# EAGLE design untitled (EAGLE 9.6.2)
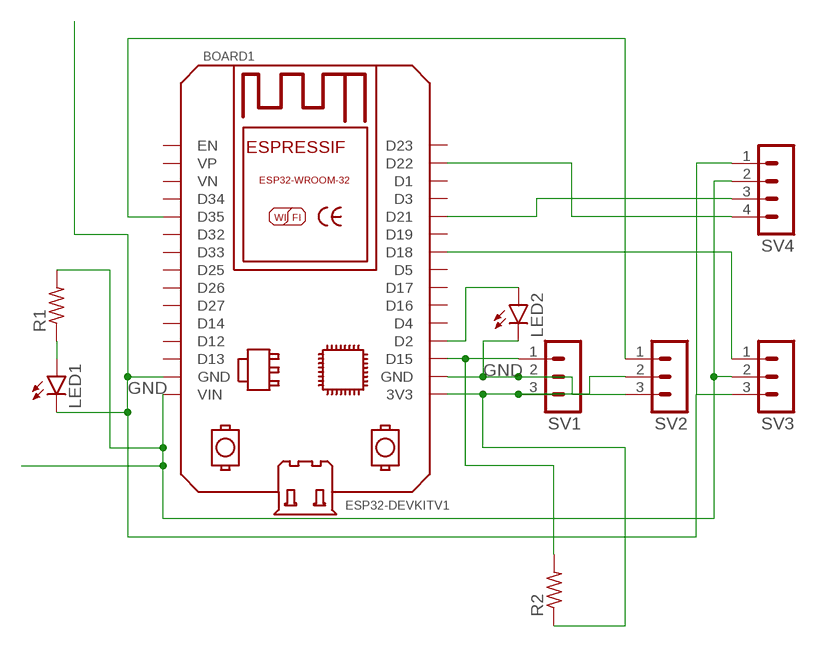
[diagram p0: schematic, sheet 1]

## Parts
BOARD1  ESP32DEVKITV1  [ESP32-DEVKITV1]
LED1  LED5MM  [LED5MM]
LED2  LED5MM  [LED5MM]
R1  R-US_0204/7  [0204/7]
R2  R-US_0204/7  [0204/7]
SV1  MA03-1  [MA03-1]
SV2  MA03-1  [MA03-1]
SV3  MA03-1  [MA03-1]
SV4  MA04-1  [MA04-1]

## Nets
GND: BOARD1.GND BOARD1.GND@1(GND) LED1.K(C) LED2.K(C) SV1.2 SV2.3 SV3.3 SV4.1
N$1: BOARD1.3V3 R2.1 SV1.3 SV2.2
N$3: BOARD1.D15 R2.2 SV1.1
N$5: BOARD1.D18 SV3.1
N$6: LED1.A R1.1
N$7: BOARD1.D21 SV4.3
N$8: BOARD1.D22 SV4.4
N$9: BOARD1.D35 SV2.1
N$11: BOARD1.D2 LED2.A
N$13: BOARD1.VIN R1.2 SV3.2 SV4.2
Unconnected: BOARD1.D1 BOARD1.D3 BOARD1.D4 BOARD1.D5 BOARD1.D12 BOARD1.D13 BOARD1.D14 BOARD1.D16 BOARD1.D17 BOARD1.D19 BOARD1.D23 BOARD1.D25 BOARD1.D26 BOARD1.D27 BOARD1.D32 BOARD1.D33 BOARD1.D34 BOARD1.EN BOARD1.VN BOARD1.VP

## Library data of the parts
BOARD1 = ESP32-DEVKITV1:ESP32DEVKITV1: https://github.com/shridattdudhat
LED1 LED2 = led:LED: LED OSRAM: - CHIPLED LG R971, LG N971, LY N971, LG Q971, LY Q971, LO R971, LY R971 LH N974, LH R974 LS Q976, LO Q976, LY Q976 LO Q996 - Hyper CHIPLED LW Q18S LB Q993, LB Q99A, LB R99A - SideLED LS A670, LO A670, LY A670, LG A670, LP A670 LB A673, LV A673, LT A673, LW A673 LH A674 LY A675 LS A676, LA A676, LO A676, LY A676, LW A676 LS A679, LY A679, LG A679 - Hyper Micro SIDELED® LS Y876, LA Y876, LO Y876, LY Y876 LT Y87S - SmartLED LW L88C, LW L88S LB L89C, LB L89S, LG L890 LS L89K, LO L89K, LY L89K LS L896, LA L896, LO L896, LY L896 - TOPLED LS T670, LO T670, LY T670, LG T670, LP T670 LSG T670, LSP T670, LSY T670, LOP T670, LYG T670 LG T671, LOG T671, LSG T671 LB T673, LV T673, LT T673, LW T673 LH T674 LS T676, LA T676, LO T676, LY T676, LB T676, LH T676, LSB T676, LW T676 LB T67C, LV T67C, LT T67C, LS T67K, LO T67K, LY T67K, LW E67C LS E67B, LA E67B, LO E67B, LY E67B, LB E67C, LV E67C, LT E67C LW T67C LS T679, LY T679, LG T679 LS T770, LO T770, LY T770, LG T770, LP T770 LB T773, LV T773, LT T773, LW T773 LH T774 LS E675, LA E675, LY E675, LS T675 LS T776, LA T776, LO T776, LY T776, LB T776 LHGB T686 LT T68C, LB T68C - Hyper Mini TOPLED® LB M676 - Mini TOPLED Santana® LG M470 LS M47K, LO M47K, LY M47K Source: http://www.osram.convergy.de LUXEON: - LUMILED® LXK2-PW12-R00, LXK2-PW12-S00, LXK2-PW14-U00, LXK2-PW14-V00 LXK2-PM12-R00, LXK2-PM12-S00, LXK2-PM14-U00 LXK2-PE12-Q00, LXK2-PE12-R00, LXK2-PE12-S00, LXK2-PE14-T00, LXK2-PE14-U00 LXK2-PB12-K00, LXK2-PB12-L00, LXK2-PB12-M00, LXK2-PB14-N00, LXK2-PB14-P00, LXK2-PB14-Q00 LXK2-PR12-L00, LXK2-PR12-M00, LXK2-PR14-Q00, LXK2-PR14-R00 LXK2-PD12-Q00, LXK2-PD12-R00, LXK2-PD12-S00 LXK2-PH12-R00, LXK2-PH12-S00 LXK2-PL12-P00, LXK2-PL12-Q00, LXK2-PL12-R00 Source: www.luxeon.com KINGBRIGHT: KA-3528ASYC Source: www.kingbright.com
R1 R2 = rcl:R-US_: RESISTOR, American symbol; SPICEPREFIX: R
SV1-SV3 = con-lstb:MA03-1: PIN HEADER; OC_FARNELL: unknown; OC_NEWARK: unknown
SV4 = con-lstb:MA04-1: PIN HEADER; OC_FARNELL: unknown; OC_NEWARK: unknown

## Board
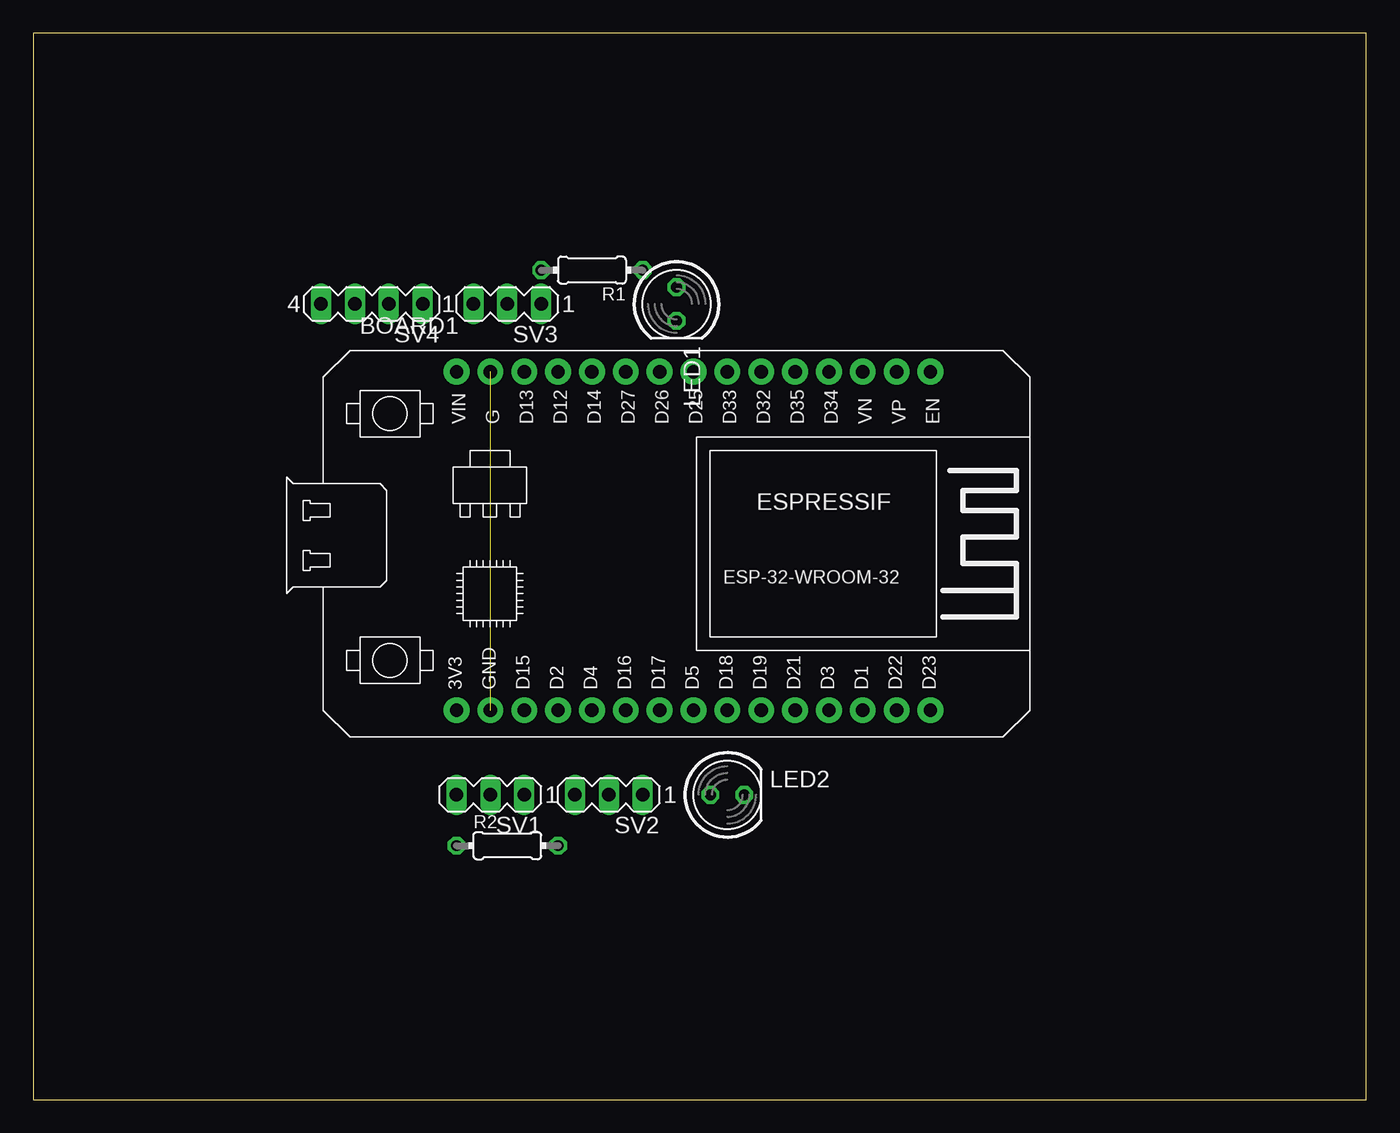
[diagram p1: board, top side]
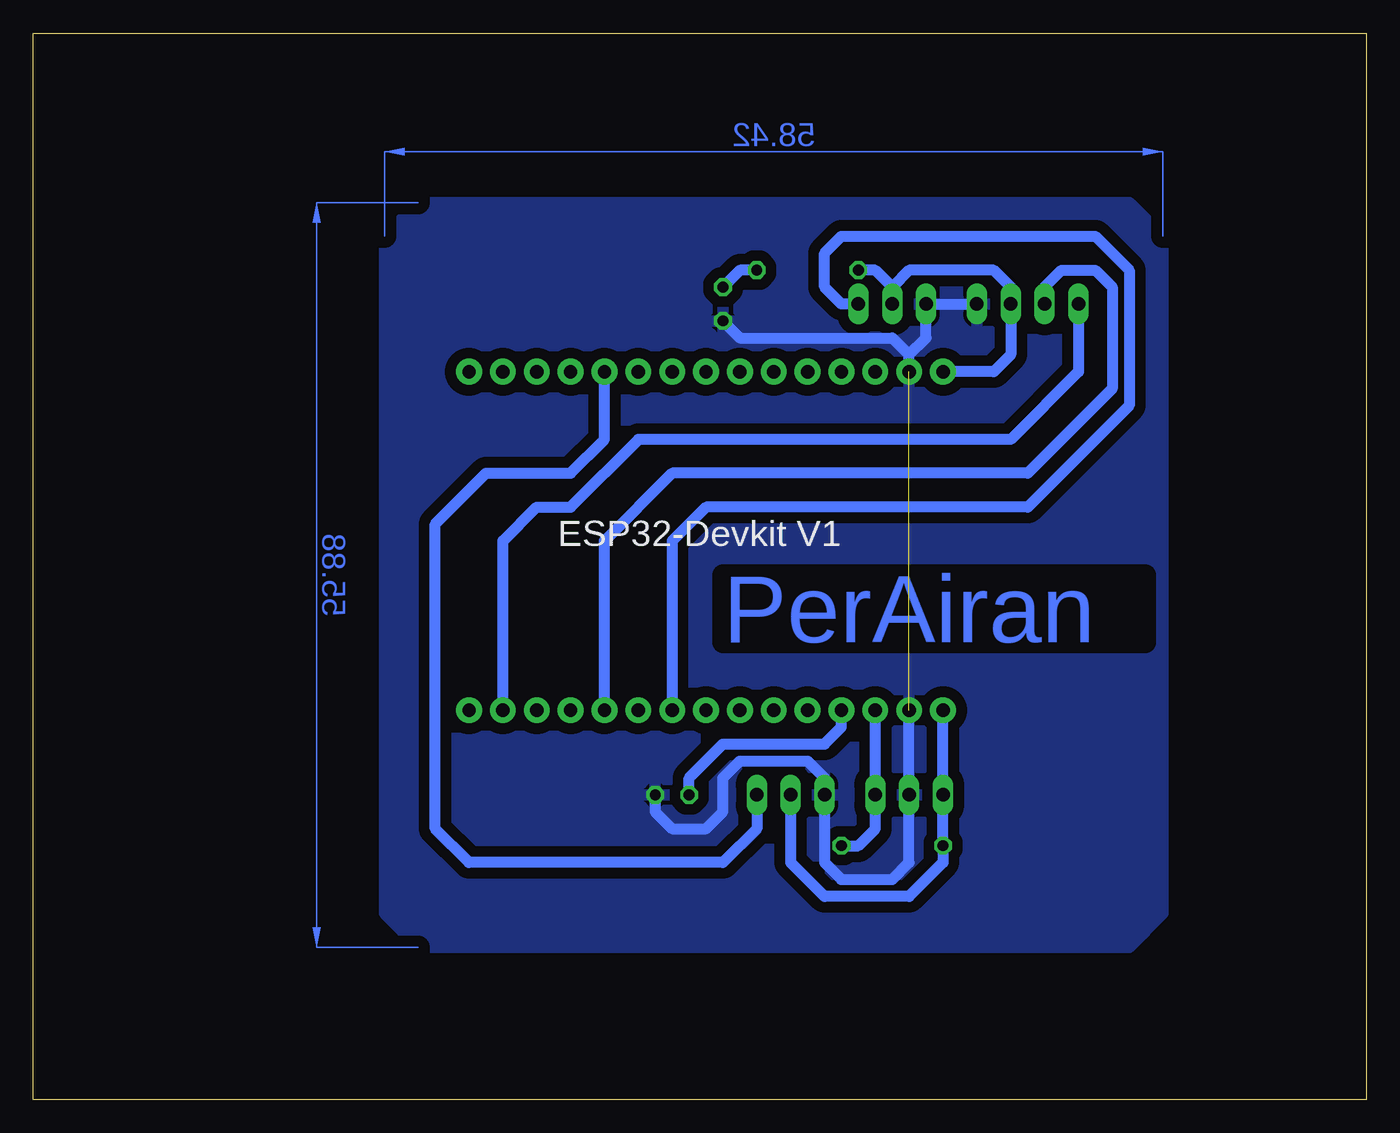
[diagram p2: board, bottom side, seen from below]

Size 100 x 80 mm. Coordinates in mm from the lower left corner, seen from the top.
Outline: 0,0 100,0 100,80 0,80 0,0
Copper layers (1*16): Top 0.035mm / dielectric 1.5mm / Bottom 0.035mm
Design rules "default": minimum track width 6mil, minimum drill 0.35mm, track to track 6mil, track to pad 6mil, pad to pad 6mil, via to via 6mil, smd to smd 6mil, copper to edge 40mil, drill to drill 6mil, minimum pad ring 10mil, minimum via ring 8mil, stop-mask expansion 4mil, vias tented up to drill 0mil, thermal gap 10mil

### Footprints (pad centres in the part's own frame; a part is rotated, then mirrored left to right if it is on the bottom)
ESP32-DEVKITV1 = drill 1 pad 1.93: 3V3 0,0; D1 30.48,0; D2 7.62,0; D3 27.94,0; D4 10.16,0; D5 17.78,0; D12 7.62,25.4; D13 5.08,25.4; D14 10.16,25.4; D15 5.08,0; D16 12.7,0; D17 15.24,0; D18 20.32,0; D19 22.86,0; D21 25.4,0; D22 33.02,0; D23 35.56,0; D25 17.78,25.4; D26 15.24,25.4; D27 12.7,25.4; D32 22.86,25.4; D33 20.32,25.4; D34 27.94,25.4; D35 25.4,25.4; EN 35.56,25.4; GND 2.54,25.4; GND@1 2.54,0; VIN 0,25.4; VN 30.48,25.4; VP 33.02,25.4
LED5MM = drill 0.813 octagon: A -1.27,0; K 1.27,0
0204/7 = drill 0.813 octagon: 1 -3.81,0; 2 3.81,0
MA03-1 = drill 1.016 long: 1 -2.54,0; 2 0,0; 3 2.54,0
MA04-1 = drill 1.016 long: 1 -3.81,0; 2 -1.27,0; 3 1.27,0; 4 3.81,0

### Placement (x,y rotation side)
BOARD1  31.75,29.21 0 top
LED1  48.26,59.69 270 top
LED2  52.07,22.86 0 top
R1  41.91,62.23 180 top
R2  35.56,19.05 0 top
SV1  34.29,22.86 180 top
SV2  43.18,22.86 180 top
SV3  35.56,59.69 180 top
SV4  25.4,59.69 180 top

### Tracks (layer width: path | path; a pad name or v marks a point on that pad's centre or on a via)
GND  (1 unrouted)
  Bottom 0.813: SV4.1 SV3.3 33.02,57.15 34.29,55.88 | BOARD1.GND 34.29,55.88 | LED1.K 46.99,57.15 35.56,57.15 34.29,55.88 | BOARD1.GND@1 SV1.2 34.29,17.78 35.56,16.51 39.37,16.51 40.64,17.78 SV2.3 40.64,24.13 41.91,25.4 46.99,25.4 48.26,24.13 48.26,21.59 49.53,20.32 52.07,20.32 53.34,21.59 LED2.K
  pour Bottom (isolate 0.813): 15.24,52.07 15.24,64.77 17.78,67.31 71.12,67.31 73.66,64.77 73.66,16.51 73.66,13.97 71.12,11.43 19.05,11.43 17.78,11.43 15.24,13.97
N$1
  Bottom 0.813: BOARD1.3V3 SV1.3 R2.1 31.75,17.78 34.29,15.24 40.64,15.24 43.18,17.78 SV2.2
N$3
  Bottom 0.813: BOARD1.D15 SV1.1 36.83,20.32 38.1,19.05 R2.2
N$5
  Bottom 0.813: SV3.1 39.37,59.69 40.64,60.96 40.64,63.5 39.37,64.77 20.32,64.77 17.78,62.23 17.78,52.07 25.4,44.45 49.53,44.45 52.07,41.91 BOARD1.D18
N$6
  Bottom 0.813: LED1.A 46.99,62.23 R1.1
N$7
  Bottom 0.813: SV4.3 24.13,60.96 22.86,62.23 20.32,62.23 19.05,60.96 19.05,53.34 25.4,46.99 52.07,46.99 57.15,41.91 BOARD1.D21
N$8
  Bottom 0.813: SV4.4 21.59,54.61 26.67,49.53 54.61,49.53 59.69,44.45 62.23,44.45 64.77,41.91 BOARD1.D22
N$9
  Bottom 0.813: SV2.1 45.72,20.32 48.26,17.78 67.31,17.78 69.85,20.32 69.85,43.18 66.04,46.99 59.69,46.99 57.15,49.53 BOARD1.D35
N$11
  Bottom 0.813: LED2.A 50.8,24.13 48.26,26.67 40.64,26.67 39.37,27.94 BOARD1.D2
N$13
  Bottom 0.813: BOARD1.VIN 27.94,54.61 26.67,55.88 SV4.2 26.67,60.96 27.94,62.23 34.29,62.23 35.56,60.96 | SV3.2 35.56,60.96 | 35.56,60.96 36.83,62.23 R1.2
(copper drawn outside any net)
  shapes: Bottom area x2

### Text on the board
Bottom: PerAiran